# EAGLE design current-sensor (EAGLE 9.2.2)
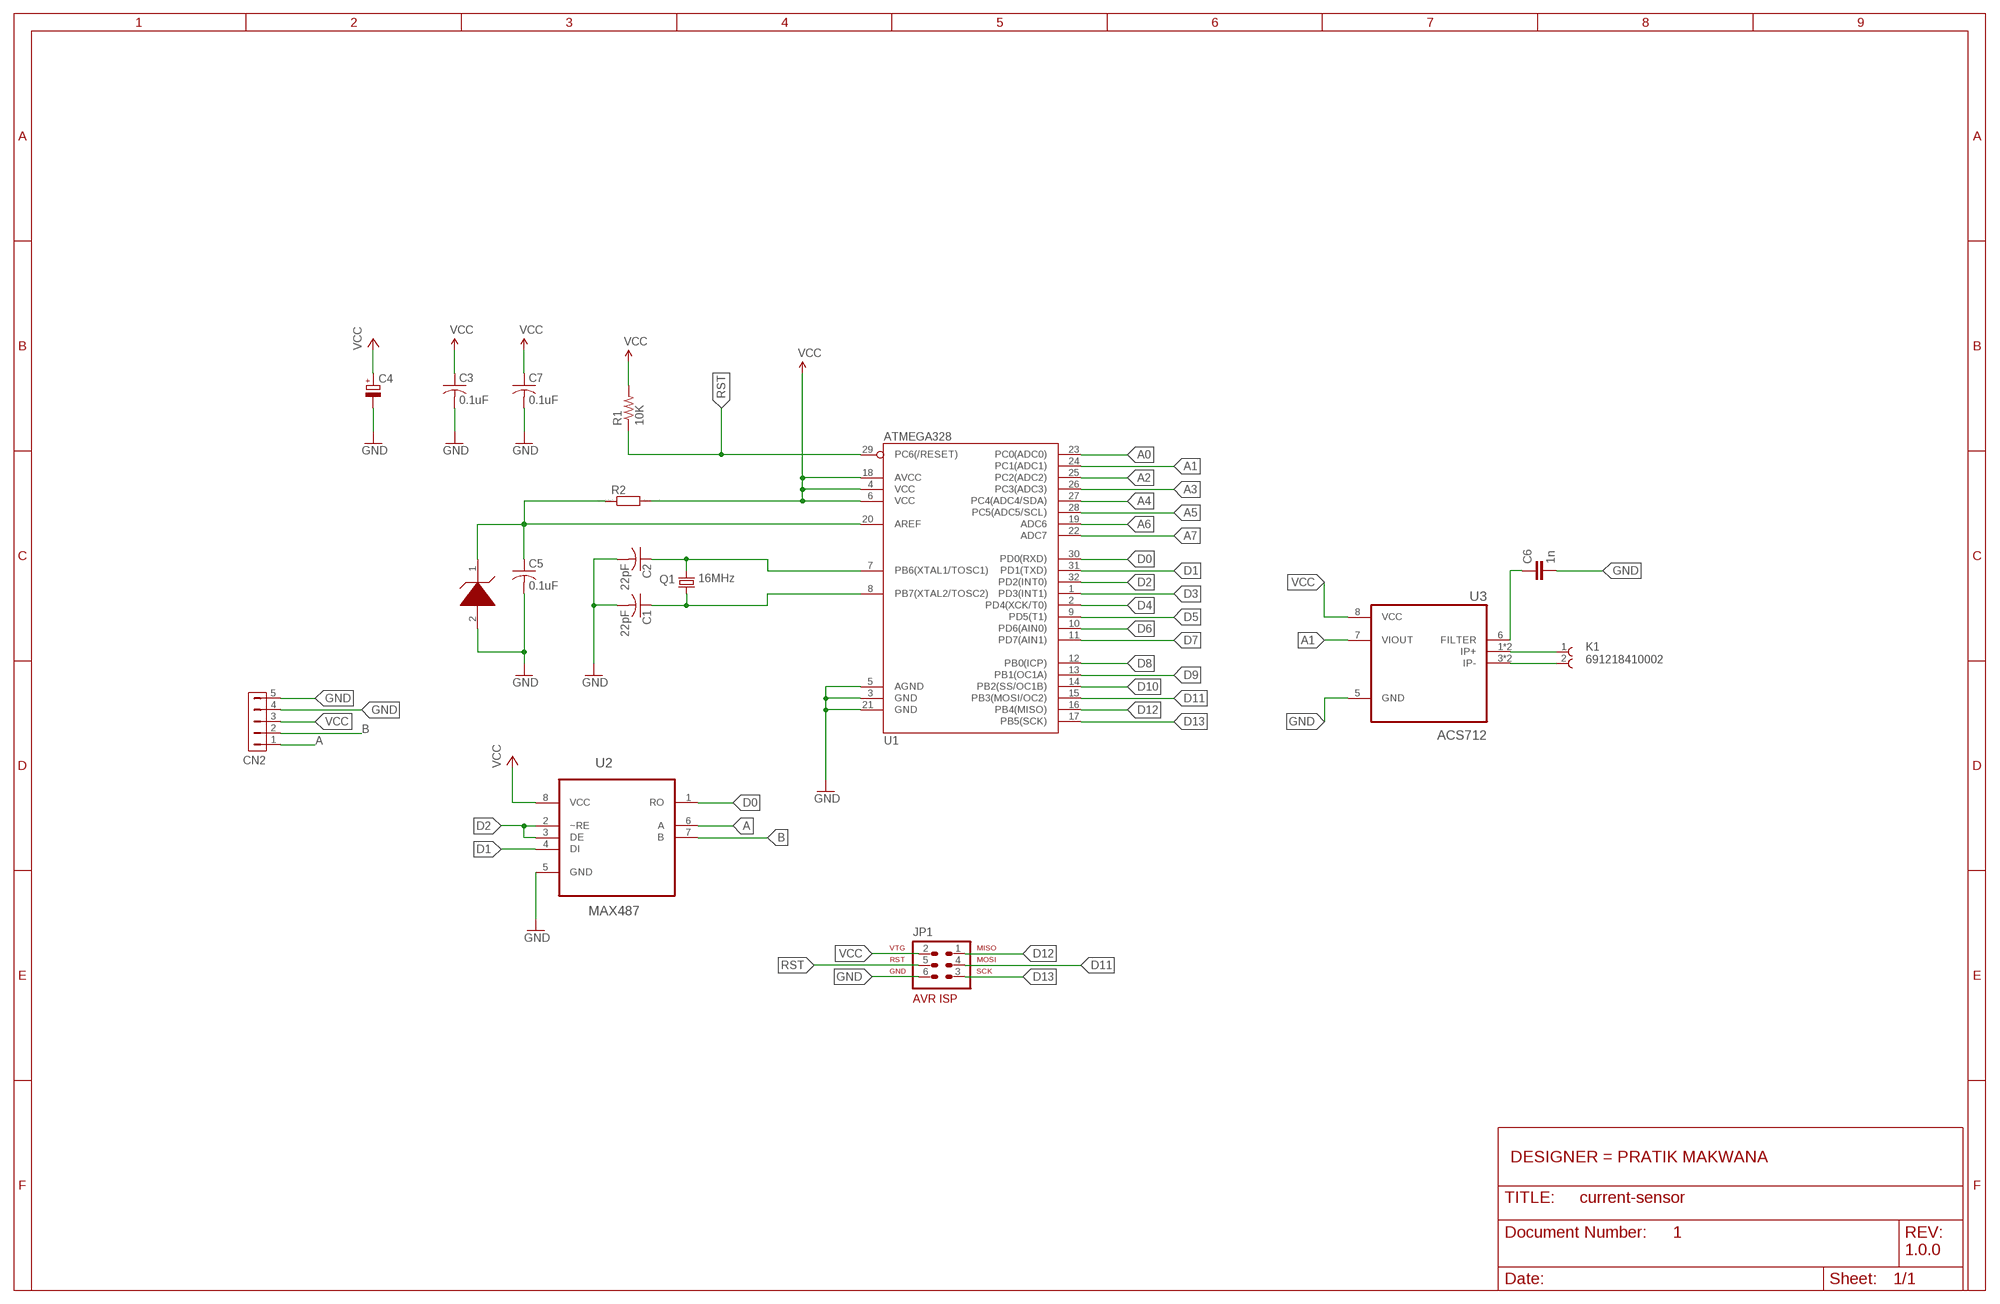
[diagram p0: schematic, sheet 1]
FRAME1 (FRAME_B_L): DESIGNER: PRATIK MAKWANA; DOC: 1; REV: 1.0.0

## Parts
C1  22pF  C-USC1206  [C1206]
C2  22pF  C-USC1206  [C1206]
C3  0.1uF  C-USC0805  [C0805]
C4  CPOL-EUSANYO_SMD_C6  [SANYO-OSCON_SMD_C6]
C5  0.1uF  C-USC0805  [C0805]
C6  1n  C-EUC1206  [C1206]
C7  0.1uF  C-USC0805  [C0805]
CN2  HDR-1X5-SIP-100  [SIP-100-5V]
JP1  AVR-ISP-6  [AVR-ISP-6]
K1  691218410002  [691218410002]
Q1  16MHz  CRYTALHC49S  [HC49/S]
R1  10K  R-US_R1206  [R1206]
R2  RR1206  [R1206]
U1  ATMEGA328  [TQFP32-08]
U2  MAX487  MAX487ESA+TCBX  [SOIC127P600X175-8N]
U3  ACS712  ACS712ELCTR-20A-T  [SOIC127P600X175-8N]
U$1  LM4040  [SOT23]

## Nets
A: CN2.1 U2.6(A)
A0: U1.23(PC0(ADC0))
A1: U1.24(PC1(ADC1)) U3.7(VIOUT)
A2: U1.25(PC2(ADC2))
A3: U1.26(PC3(ADC3))
A4: U1.27(PC4(ADC4/SDA))
A5: U1.28(PC5(ADC5/SCL))
A6: U1.19(ADC6)
A7: U1.22(ADC7)
AREF: C5.1 R2.1 U1.20(AREF) U$1.1(CATHODE)
B: CN2.2 U2.7(B)
D0: U1.30(PD0(RXD)) U2.1(RO)
D1: U1.31(PD1(TXD)) U2.4(DI)
D2: U1.32(PD2(INT0)) U2.2(~RE) U2.3(DE)
D3: U1.1(PD3(INT1))
D4: U1.2(PD4(XCK/T0))
D5: U1.9(PD5(T1))
D6: U1.10(PD6(AIN0))
D7: U1.11(PD7(AIN1))
D8: U1.12(PB0(ICP))
D9: U1.13(PB1(OC1A))
D10: U1.14(PB2(SS/OC1B))
D11: JP1.4 U1.15(PB3(MOSI/OC2))
D12: JP1.1 U1.16(PB4(MISO))
D13: JP1.3 U1.17(PB5(SCK))
GND: C1.2 C2.2 C3.2 C4.- C5.2 C6.2 C7.2 CN2.4 CN2.5 JP1.6 U1.3(GND) U1.5(AGND) U1.21(GND) U2.5(GND) U3.5(GND) U$1.2(ANODE)
N$1: K1.1 U3.1(IP+) U3.2(IP+)
N$2: K1.2 U3.3(IP-) U3.4(IP-)
N$3: C6.1 U3.6(FILTER)
N$43: C2.1 Q1.2 U1.7(PB6(XTAL1/TOSC1))
N$44: C1.1 Q1.1 U1.8(PB7(XTAL2/TOSC2))
RST: JP1.5 R1.1 U1.29(PC6(/RESET))
VCC: C3.1 C4.+ C7.1 CN2.3 JP1.2 R1.2 R2.2 U1.4(VCC) U1.6(VCC) U1.18(AVCC) U2.8(VCC) U3.8(VCC)

## Library data of the parts
C1-C3 C5 C7 = adafruit:C-US: CAPACITOR, American symbol
C4 = rcl:CPOL-EU: POLARIZED CAPACITOR, European symbol; SPICEPREFIX: C
C6 = rcl:C-EU: CAPACITOR, European symbol; SPICEPREFIX: C
CN2 = con-hdrs40:HDR-1X5: HEADER CONNECTOR
JP1 = atmel-1:AVR-ISP-6: AVR ISP-6 Serial Programming Header
K1 = Wurth_Elektronik_Electromechanic_Terminal_Blocks_Connectors_rev15c:691218410002: WR-TBL Serie 2184 - 7.62mm Horizontal Entry Modular with Rising Cage Clamp - 5.3mm2 Wires, 2 Pins=>Code : Con_TBL_Screw_RisingClamp_7.62_691218410002 <http://katalog.we-online.de/media/images/eican/Con_TBL_Screw_RisingClamp_7.62_6912184100xx_pf2.jpg> Details see: http://katalog.we-online.de/en/em/691_218_410_0xx Created 2014-06-18, Karrer Zheng 2014 (C) Würth Elektronik
Q1 = crystal:CRYTAL: CRYSTAL
R1 = adafruit:R-US_: RESISTOR, American symbol
R2 = eagle-ltspice:R: RESISTOR, European symbol; SPICEMODEL: NONE; SPICEPREFIX: R
U1 = thecustomgeek:ATMEGA328: ATmega328P-AU TQFP 32 pin
U2 = MAX487ESA_TCBX:MAX487ESA+TCBX: Low-Power, Slew-Rate-Limited RS-485/RS-422 Transceivers Check prices <https://pricing.snapeda.com/parts/MAX487ESA%2BTCBX/Maxim%20Integrated/view-part?ref=eda>; AVAILABILITY: Warning; DESCRIPTION: 1/1 Transceiver Half RS422, RS485 8-SOIC; MF: Maxim Integrated; MP: MAX487ESA+TCBX; PACKAGE: SOIC-8 Maxim Integrated; PRICE: None; PURCHASE-URL: https://pricing.snapeda.com/search/part/MAX487ESA+TCBX/?ref=eda
U3 = ACS712ELCTR-20A-T:ACS712ELCTR-20A-T; AVAILABILITY: Unavailable; DESCRIPTION: Current Sensor 20A 1 Channel Hall Effect, Open Loop Bidirectional 8-SOIC (0.154, 3.90mm Width); MF: Allegro; MP: ACS712ELCTR-20A-T; PACKAGE: SOIC-8 Allegro MicroSystems LLC; PRICE: None
U$1 = dawidkulpa_dev:LM4040: Shunt Voltage Reference Fixed reverse breakdown voltages of: 2.048 V, 2.5 V, 3 V, 4.096 V, 5 V, 8.192 V, and 10 V

## Board
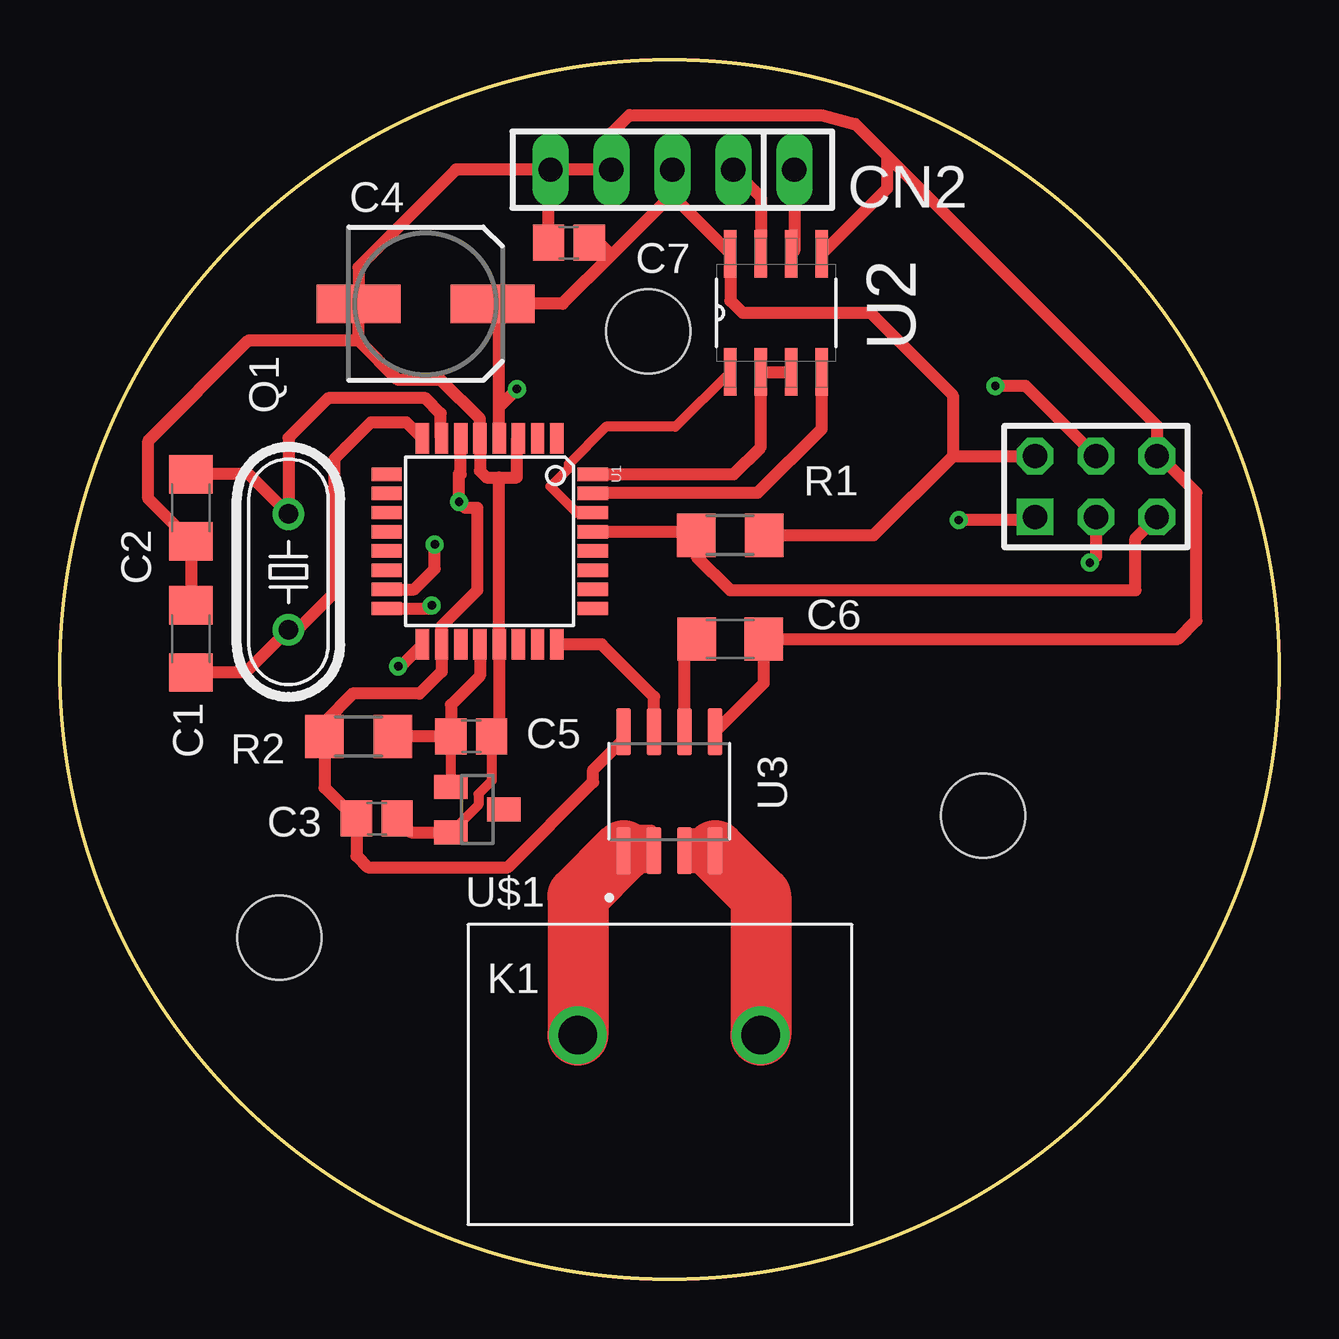
[diagram p1: board, top side]
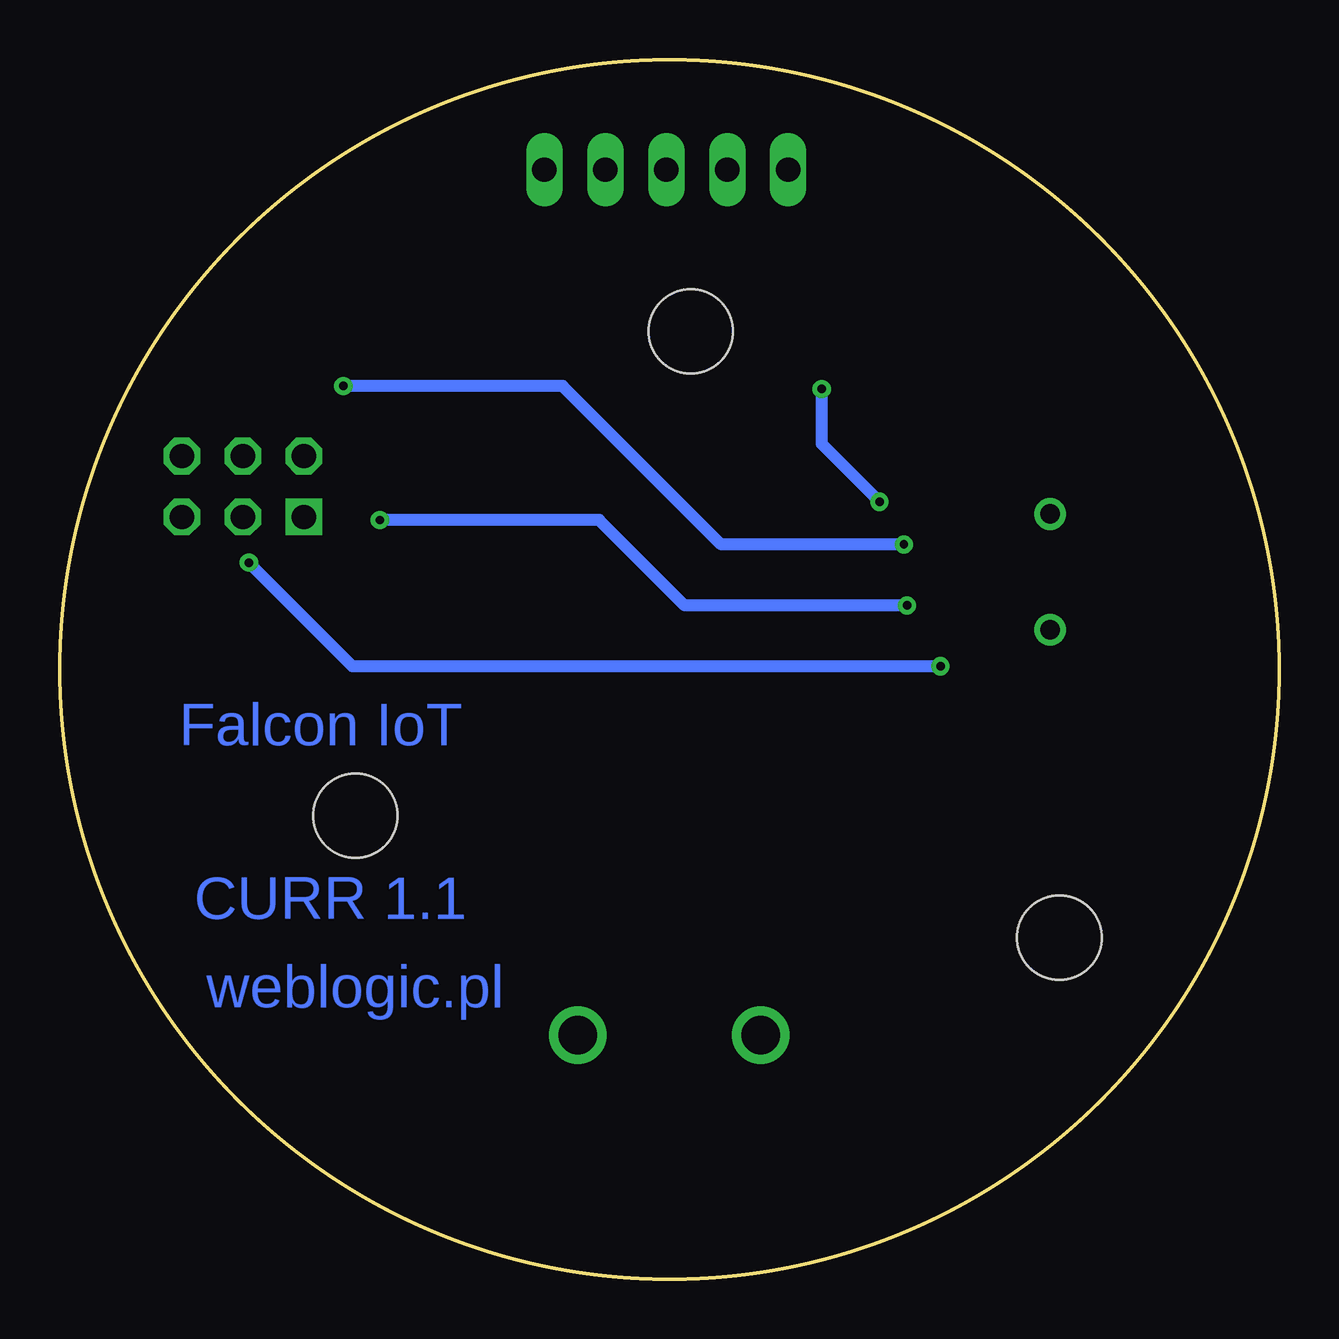
[diagram p2: board, bottom side, seen from below]

Size 50.8 x 50.8 mm. Coordinates in mm from the lower left corner, seen from the top.
Outline: circle at 25.4,25.4 radius 25.4
Copper layers (1*16): Top 0.035mm / dielectric 1.5mm / Bottom 0.035mm
Design rules "default": minimum track width 6mil, minimum drill 0.35mm, track to track 6mil, track to pad 6mil, pad to pad 6mil, via to via 6mil, smd to smd 6mil, copper to edge 40mil, drill to drill 6mil, minimum pad ring 10mil, minimum via ring 8mil, stop-mask expansion 4mil, vias tented up to drill 0mil, thermal gap 10mil
Holes 3.51 mm at 38.48,19.3 9.14,14.22 24.51,39.5

### Footprints (pad centres in the part's own frame; a part is rotated, then mirrored left to right if it is on the bottom)
C1206 = smd 1.6 x 1.8: 1 -1.4,0; 2 1.4,0
C0805 = smd 1.3 x 1.5: 1 -0.85,0; 2 0.85,0
SANYO-OSCON_SMD_C6 = smd 3.5 x 1.6: + 2.8,0; - -2.8,0
SIP-100-5V = drill 1.016 long: 1 -5.08,0; 2 -2.54,0; 3 0,0; 4 2.54,0; 5 5.08,0
AVR-ISP-6 = drill 1.016 square: 1 -2.54,-1.27 | drill 1.016 octagon: 2 -2.54,1.27; 3 0,-1.27; 4 0,1.27; 5 2.54,-1.27; 6 2.54,1.27
691218410002 = drill 1.6: 1 -7.62,0; 2 0,0
HC49/S = drill 0.813: 1 -2.413,0; 2 2.413,0
R1206 = smd 1.6 x 1.803: 1 -1.422,0; 2 1.422,0
TQFP32-08 = smd 1.27 x 0.559: 1 -4.293,2.8; 2 -4.293,2; 3 -4.293,1.2; 4 -4.293,0.4; 5 -4.293,-0.4; 6 -4.293,-1.2; 7 -4.293,-2; 8 -4.293,-2.8; 17 4.293,-2.8; 18 4.293,-2; 19 4.293,-1.2; 20 4.293,-0.4; 21 4.293,0.4; 22 4.293,1.2; 23 4.293,2; 24 4.293,2.8 | smd 0.559 x 1.27: 9 -2.8,-4.293; 10 -2,-4.293; 11 -1.2,-4.293; 12 -0.4,-4.293; 13 0.4,-4.293; 14 1.2,-4.293; 15 2,-4.293; 16 2.8,-4.293; 25 2.8,4.293; 26 2,4.293; 27 1.2,4.293; 28 0.4,4.293; 29 -0.4,4.293; 30 -1.2,4.293; 31 -2,4.293; 32 -2.8,4.293
SOIC127P600X175-8N = smd 1.981 x 0.533: 1 -2.464,1.905; 2 -2.464,0.635; 3 -2.464,-0.635; 4 -2.464,-1.905; 5 2.464,-1.905; 6 2.464,-0.635; 7 2.464,0.635; 8 2.464,1.905
SOIC127P600X175-8N' = smd 1.97 x 0.6: 1 -2.475,1.905; 2 -2.475,0.635; 3 -2.475,-0.635; 4 -2.475,-1.905; 5 2.475,-1.905; 6 2.475,-0.635; 7 2.475,0.635; 8 2.475,1.905
SOT23 = smd 1 x 1.4: 1 -0.95,-1.1; 2 0.95,-1.1; 3 0,1.1

### Placement (x,y rotation side)
C1  5.46,26.67 90 top
C2  5.46,32.13 270 top
C3  13.21,19.18 0 top
C4  15.24,40.64 0 top
C5  17.14,22.61 0 top
C6  27.94,26.67 0 top
C7  21.21,43.18 180 top
CN2  25.53,46.23 180 top
JP1  43.18,33.02 0 top
K1  29.21,10.16 0 top
Q1  9.52,29.46 90 top
R1  27.94,30.99 0 top
R2  12.45,22.61 180 top
U1  17.91,30.73 270 top
U2  29.84,40.26 90 top
U3  ACS712  [SOIC127P600X175-8N']  25.4,20.32 90 top
U$1  17.4,19.56 270 top

### Tracks (layer width: path | path; a pad name or v marks a point on that pad's centre or on a via)
A
  Top 0.508: CN2.1 30.61,42.85 U2.6
A1
  Top 0.508: U3.7 24.76,24.26 22.58,26.44 U1.24
AREF
  Top 0.406: U$1.1 C5.1
  Top 0.508: U1.20 17.51,25.13 16.29,23.91 C5.1 R2.1
B
  Top 0.508: CN2.2 29.21,45.08 U2.7
D0
  Top 0.406: U1.30 21.53,31.93 20.45,33.02 21.21,33.78 21.21,33.96 22.76,35.51 25.65,35.51 U2.1
D1
  Top 0.508: U1.31 22.23,32.77 29.08,32.77 31.75,35.43 U2.4
D2
  Top 0.508: U1.32 28.07,33.53 29.21,34.67 U2.2 U2.3
D11  (via drill 0.35)
  Top 0.508: JP1.4 40.26,37.21 v38.99,37.21 | U1.15 14.76,28.73 15.62,29.59 v15.62,30.61
  Bottom 0.508: v15.62,30.61 23.24,30.61 29.84,37.21 v38.99,37.21
D12  (via drill 0.35)
  Top 0.508: JP1.1 40.51,31.62 v37.46,31.62 | U1.16 15.36,27.93 v15.49,28.07
  Bottom 0.508: v15.49,28.07 24.76,28.07 28.32,31.62 v37.46,31.62
D13  (via drill 0.35)
  Top 0.508: JP1.3 43.18,30.1 v42.93,29.84 | U1.17 14.19,25.53 v14.1,25.53
  Bottom 0.508: v14.1,25.53 38.61,25.53 v42.93,29.84
GND
  Top 0.406: U$1.2 17.44,19.75 17.44,20.2 17.99,20.76 C5.2
  Top 0.508: U3.5 29.34,24.83 C6.2 46.61,26.67 47.37,27.43 47.37,32.77 45.72,34.42 | CN2.5 CN2.4 22.99,47.75 23.73,48.5 | CN2.5 16.51,46.23 12.45,42.16 C4.- 12.45,39.12 | 12.45,39.12 14.1,37.46 15.87,37.46 17.51,35.83 U1.5 17.51,33.67 17.78,33.4 18.29,33.4 | 18.29,33.4 19.05,33.4 19.05,34.97 U1.3 | 18.29,33.4 18.31,33.38 U1.21 18.31,22.92 C5.2 | 23.73,48.5 23.75,48.5 | 23.73,48.5 31.78,48.5 33.15,48.13 34.48,46.8 | 34.48,46.8 45.72,35.56 45.72,34.42 | 45.72,34.42 JP1.6 | U2.5 34.48,45.45 34.48,46.8 | C2.2 C1.2 | C2.2 5.08,30.73 | C2.2 3.68,32.51 3.68,34.92 7.87,39.12 12.45,39.12 | C7.2 20.36,46.14 CN2.5 | C3.2 14.63,18.61 U$1.2
N$1
  Top 0.508: U3.2 24.13,17.84 24.13,17.4 23.88,17.14 24.51,17.14 24.51,17.78 23.88,18.41 23.75,18.41 23.49,18.67 24.64,18.67 24.64,18.54 23.94,17.84 U3.1
  Top 2.54: U3.1 21.59,15.94 K1.1
N$2
  Top 0.508: 27.24,17.78 26.1,17.78 U3.3 26.73,17.14 | 26.73,17.14 27.18,17.14 | 26.73,17.14 26.29,17.14 26.16,17.27 26.16,18.54 27.18,18.54
  Top 1.27: K1.2 29.21,16.51 27.94,17.78 27.37,17.78 U3.4 27.24,17.78 26.54,17.78
  Top 2.54: U3.4 29.21,15.94 K1.2
N$3
  Top 0.508: U3.6 26.03,26.16 C6.1
N$43
  Top 0.508: U1.7 15.87,35.06 15.87,36.07 15.24,36.7 11.18,36.7 9.52,35.05 Q1.2 7.87,33.53 C2.1
N$44
  Top 0.508: U1.8 14.45,35.69 12.95,35.69 11.43,34.16 11.43,28.57 9.91,27.05 Q1.1 7.74,25.27 C1.1
RST
  Top 0.508: U1.29 26.37,31.13 R1.1 26.52,30.12 27.94,28.7 44.83,28.7 44.83,30.86 JP1.5
VCC  (via drill 0.35)
  Top 0.508: 22.99,42.67 25.53,45.21 CN2.3 25.53,45.14 U2.8 27.94,40.77 28.45,40.26 33.78,40.26 37.21,36.83 37.21,34.29 | 22.99,42.67 20.95,40.64 C4.+ 18.31,40.37 U1.4 18.31,36.34 v19.05,37.08 | R1.2 33.91,30.99 37.21,34.29 | 37.21,34.29 JP1.2 | U1.6 16.71,33.52 16.64,33.59 v16.64,32.38 16.89,32.13 17.4,32.13 17.4,28.7 15.91,27.21 U1.18 15.91,25.3 14.99,24.38 12.19,24.38 11.02,23.22 R2.2 11.02,20.47 12.32,19.18 C3.1 12.36,17.61 12.83,17.14 18.67,17.14 22.22,20.7 22.22,21.21 23.49,22.48 U3.8 | C7.1 22.48,43.18 22.99,42.67
  Bottom 0.508: v16.64,32.38 19.05,34.8 v19.05,37.08

### Text on the board
Bottom: Falcon IoT | CURR 1.1 | weblogic.pl